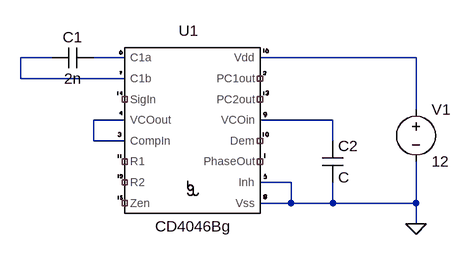
[diagram p0: schematic pll.asc]
pll.asc, the LTspice schematic file:
Version 4.1
SHEET 1 880 680
WIRE 96 -64 48 -64
WIRE 208 -64 160 -64
WIRE 656 -64 416 -64
WIRE 48 -32 48 -64
WIRE 208 -32 48 -32
WIRE 656 16 656 -64
WIRE 208 32 160 32
WIRE 528 32 416 32
WIRE 160 64 160 32
WIRE 208 64 160 64
WIRE 528 64 528 32
WIRE 464 128 416 128
WIRE 464 160 464 128
WIRE 464 160 416 160
WIRE 528 160 528 128
WIRE 528 160 464 160
WIRE 656 160 656 96
WIRE 656 160 528 160
WIRE 656 192 656 160
FLAG 656 192 0
SYMBOL CD4046Bg 320 80 R0
SYMATTR InstName U1
SYMBOL voltage 656 0 R0
WINDOW 123 0 0 Left 0
WINDOW 39 0 0 Left 0
SYMATTR InstName V1
SYMATTR Value 12
SYMBOL cap 160 -80 R90
WINDOW 0 0 32 VBottom 2
WINDOW 3 32 32 VTop 2
SYMATTR InstName C1
SYMATTR Value 2n
SYMBOL cap 512 64 R0
SYMATTR InstName C2

The netlist it stands for:
* pll.asc
X§U1 N002 N001 N004 0 NC_01 NC_02 NC_03 N005 N003 0 NC_04 NC_05 NC_06 NC_07 N004 NC_08 CD4046Bg  ; pins C1a C1b CompIn Inh R1 R2 SigIn VCOin Vdd Vss Dem PC1out PC2out PhaseOut VCOout Zen
V1 N003 0 12
C1 N002 N001 2n
C2 N005 0 C
.lib CD4046Bg.sub
.backanno
.end